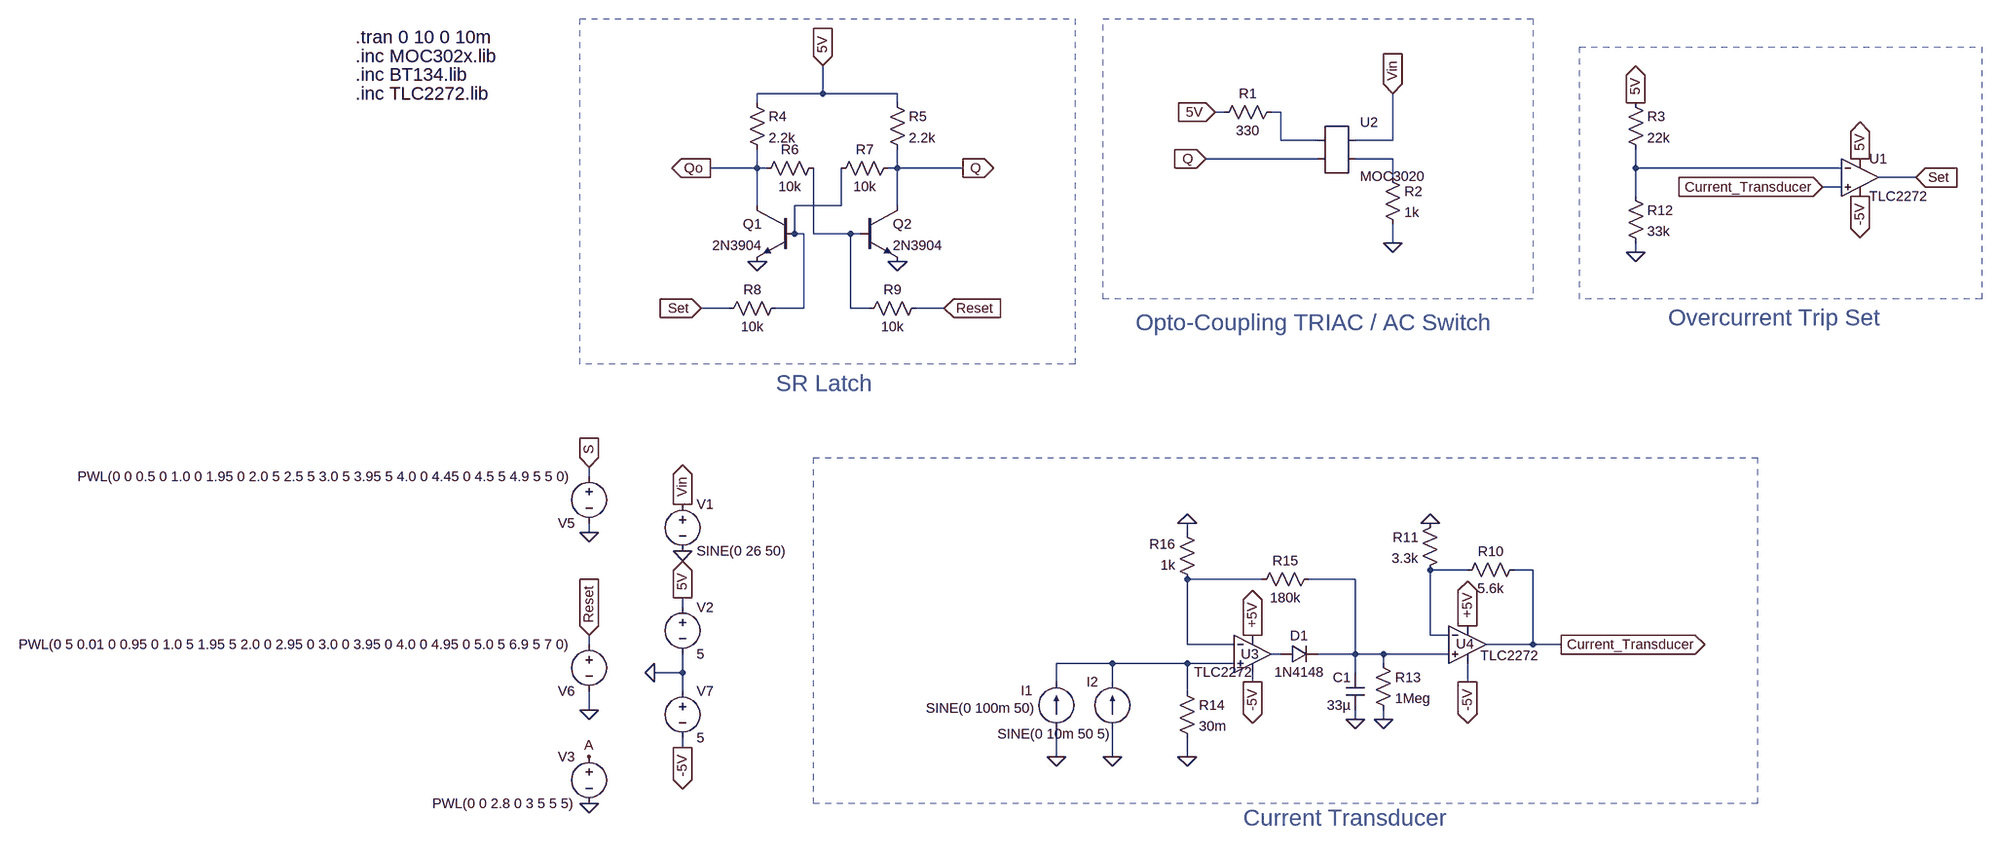
[diagram p0: schematic Muthua_21317682_A3.asc]
Muthua_21317682_A3.asc, the LTspice schematic file:
Version 4
SHEET 1 2180 916
WIRE 128 -480 128 -528
WIRE 128 -480 16 -480
WIRE 256 -480 128 -480
WIRE 16 -464 16 -480
WIRE 256 -464 256 -480
WIRE 816 -448 800 -448
WIRE 912 -448 896 -448
WIRE 912 -400 912 -448
WIRE 976 -400 912 -400
WIRE 1104 -400 1104 -480
WIRE 1104 -400 1040 -400
WIRE 976 -368 784 -368
WIRE 1104 -368 1040 -368
WIRE 16 -352 16 -384
WIRE 16 -352 -64 -352
WIRE 32 -352 16 -352
WIRE 256 -352 256 -384
WIRE 256 -352 240 -352
WIRE 368 -352 256 -352
WIRE 1520 -352 1520 -384
WIRE 1872 -352 1520 -352
WIRE 1104 -336 1104 -368
WIRE 2000 -336 1936 -336
WIRE 1872 -320 1840 -320
WIRE 1520 -304 1520 -352
WIRE 16 -288 16 -352
WIRE 160 -288 160 -352
WIRE 160 -288 80 -288
WIRE 256 -288 256 -352
WIRE 80 -240 80 -288
WIRE 96 -240 80 -240
WIRE 112 -240 112 -352
WIRE 176 -240 112 -240
WIRE 192 -240 176 -240
WIRE 1104 -224 1104 -256
WIRE 1520 -208 1520 -224
WIRE -32 -112 -80 -112
WIRE 96 -112 96 -240
WIRE 96 -112 48 -112
WIRE 176 -112 176 -240
WIRE 208 -112 176 -112
WIRE 336 -112 288 -112
WIRE -272 176 -272 160
WIRE -272 272 -272 256
WIRE 752 272 752 256
WIRE 1232 336 1168 336
WIRE 1344 336 1312 336
WIRE 880 352 752 352
WIRE 1040 352 960 352
WIRE -112 400 -112 384
WIRE 1168 448 1168 336
WIRE 1200 448 1168 448
WIRE -272 464 -272 448
WIRE 752 464 752 352
WIRE 832 464 752 464
WIRE 1344 464 1344 336
WIRE 1344 464 1264 464
WIRE 1392 464 1344 464
WIRE 912 480 896 480
WIRE 1040 480 1040 352
WIRE 1040 480 976 480
WIRE 1088 480 1040 480
WIRE 1200 480 1088 480
WIRE 624 496 528 496
WIRE 752 496 624 496
WIRE 832 496 752 496
WIRE 1088 496 1088 480
WIRE -112 512 -112 480
WIRE -112 512 -160 512
WIRE 1040 512 1040 480
WIRE 528 528 528 496
WIRE 624 528 624 496
WIRE 864 528 864 512
WIRE 1232 528 1232 496
WIRE -112 544 -112 512
WIRE 752 544 752 496
WIRE -272 576 -272 544
WIRE 1040 592 1040 576
WIRE 1088 592 1088 576
WIRE -112 640 -112 624
WIRE 528 656 528 608
WIRE 624 656 624 608
WIRE 752 656 752 624
FLAG -160 512 0
FLAG -112 304 0
FLAG -112 384 5V
IOPIN -112 384 Out
FLAG -112 224 Vin
IOPIN -112 224 Out
FLAG 1104 -480 Vin
IOPIN 1104 -480 In
FLAG 800 -448 5V
IOPIN 800 -448 In
FLAG -272 736 0
FLAG 16 -192 0
FLAG 256 -192 0
FLAG -80 -112 Set
IOPIN -80 -112 In
FLAG 336 -112 Reset
IOPIN 336 -112 In
FLAG -272 272 0
FLAG -272 576 0
FLAG -272 448 Reset
IOPIN -272 448 In
FLAG 368 -352 Q
IOPIN 368 -352 Out
FLAG -64 -352 Qo
IOPIN -64 -352 Out
FLAG 1104 -224 0
FLAG -272 656 A
FLAG 784 -368 Q
IOPIN 784 -368 In
FLAG -112 640 -5V
IOPIN -112 640 Out
FLAG 1904 -368 5V
IOPIN 1904 -368 Out
FLAG 1904 -304 -5V
IOPIN 1904 -304 Out
FLAG 1520 -208 0
FLAG 1520 -464 5V
IOPIN 1520 -464 Out
FLAG 2000 -336 Set
IOPIN 2000 -336 In
FLAG 128 -528 5V
IOPIN 128 -528 In
FLAG -272 160 S
IOPIN -272 160 In
FLAG 1040 592 0
FLAG 1168 256 0
FLAG 1088 592 0
FLAG 752 656 0
FLAG 752 256 0
FLAG 624 656 0
FLAG 528 656 0
FLAG 864 448 +5V
IOPIN 864 448 Out
FLAG 1232 432 +5V
IOPIN 1232 432 Out
FLAG 864 528 -5V
IOPIN 864 528 Out
FLAG 1232 528 -5V
IOPIN 1232 528 Out
FLAG 1392 464 Current_Transducer
IOPIN 1392 464 Out
FLAG 1840 -320 Current_Transducer
IOPIN 1840 -320 In
SYMBOL AutoGenerated\\MOC3020 1008 -384 R0
SYMATTR InstName U2
SYMBOL voltage -112 208 R0
WINDOW 123 0 0 Left 2
WINDOW 39 0 0 Left 2
SYMATTR InstName V1
SYMATTR Value SINE(0 26 50)
SYMBOL voltage -112 384 R0
WINDOW 123 0 0 Left 2
WINDOW 39 0 0 Left 2
SYMATTR InstName V2
SYMATTR Value 5
SYMBOL res 912 -464 R90
WINDOW 0 0 56 VBottom 2
WINDOW 3 32 56 VTop 2
SYMATTR InstName R1
SYMATTR Value 330
SYMBOL voltage -272 640 M0
WINDOW 123 0 0 Left 2
WINDOW 39 0 0 Left 2
SYMATTR InstName V3
SYMATTR Value PWL(0 0 2.8 0 3 5 5 5)
SYMBOL npn 80 -288 M0
SYMATTR InstName Q1
SYMATTR Value 2N3904
SYMBOL npn 192 -288 R0
SYMATTR InstName Q2
SYMATTR Value 2N3904
SYMBOL res 0 -480 R0
SYMATTR InstName R4
SYMATTR Value 2.2k
SYMBOL res 240 -480 R0
SYMATTR InstName R5
SYMATTR Value 2.2k
SYMBOL res 128 -368 R90
WINDOW 0 0 56 VBottom 2
WINDOW 3 32 56 VTop 2
SYMATTR InstName R6
SYMATTR Value 10k
SYMBOL res 256 -368 R90
WINDOW 0 0 56 VBottom 2
WINDOW 3 32 56 VTop 2
SYMATTR InstName R7
SYMATTR Value 10k
SYMBOL res 64 -128 R90
WINDOW 0 0 56 VBottom 2
WINDOW 3 32 56 VTop 2
SYMATTR InstName R8
SYMATTR Value 10k
SYMBOL res 304 -128 R90
WINDOW 0 0 56 VBottom 2
WINDOW 3 32 56 VTop 2
SYMATTR InstName R9
SYMATTR Value 10k
SYMBOL voltage -272 160 M0
WINDOW 0 24 96 Left 2
WINDOW 3 24 16 Left 2
WINDOW 123 0 0 Left 0
WINDOW 39 0 0 Left 0
SYMATTR InstName V5
SYMATTR Value PWL(0 0 0.5 0 1.0 0 1.95 0 2.0 5 2.5 5 3.0 5 3.95 5 4.0 0 4.45 0 4.5 5 4.9 5 5 0)
SYMBOL voltage -272 448 M0
WINDOW 0 24 96 Left 2
WINDOW 3 24 16 Left 2
WINDOW 123 0 0 Left 0
WINDOW 39 0 0 Left 0
SYMATTR InstName V6
SYMATTR Value PWL(0 5 0.01 0 0.95 0 1.0 5 1.95 5 2.0 0 2.95 0 3.0 0 3.95 0 4.0 0 4.95 0 5.0 5 6.9 5 7 0)
SYMBOL res 1088 -352 R0
SYMATTR InstName R2
SYMATTR Value 1k
SYMBOL Opamps\\opamp2 1904 -400 R0
SYMATTR InstName U1
SYMATTR Value TLC2272
SYMATTR SpiceModel TLC2272
SYMBOL voltage -112 528 R0
WINDOW 123 0 0 Left 2
WINDOW 39 0 0 Left 2
SYMATTR InstName V7
SYMATTR Value 5
SYMBOL res 1504 -480 R0
SYMATTR InstName R3
SYMATTR Value 22k
SYMBOL res 1504 -320 R0
SYMATTR InstName R12
SYMATTR Value 33k
SYMBOL Opamps\\opamp2 864 416 R0
WINDOW 0 -20 64 Left 2
WINDOW 3 -100 95 Left 2
SYMATTR InstName U3
SYMATTR Value TLC2272
SYMATTR SpiceModel TLC2272
SYMBOL Opamps\\opamp2 1232 400 R0
WINDOW 0 -20 63 Left 2
WINDOW 3 22 83 Left 2
SYMATTR InstName U4
SYMATTR Value TLC2272
SYMATTR SpiceModel TLC2272
SYMBOL diode 912 496 R270
WINDOW 0 32 32 VTop 2
WINDOW 3 0 32 VBottom 2
SYMATTR InstName D1
SYMATTR Value 1N4148
SYMBOL cap 1056 512 M0
SYMATTR InstName C1
SYMATTR Value 33µ
SYMBOL res 1328 320 R90
WINDOW 0 0 56 VBottom 2
WINDOW 3 32 56 VTop 2
SYMATTR InstName R10
SYMATTR Value 5.6k
SYMBOL res 1184 240 M0
SYMATTR InstName R11
SYMATTR Value 3.3k
SYMBOL res 1072 480 R0
SYMATTR InstName R13
SYMATTR Value 1Meg
SYMBOL res 736 528 R0
SYMATTR InstName R14
SYMATTR Value 30m
SYMBOL current 528 608 R180
WINDOW 0 40 65 Left 2
WINDOW 3 36 35 Left 2
WINDOW 123 0 0 Left 0
WINDOW 39 0 0 Left 0
SYMATTR InstName I1
SYMATTR Value SINE(0 100m 50)
SYMBOL current 624 608 R180
WINDOW 0 24 80 Left 2
WINDOW 3 3 -9 Left 2
WINDOW 123 0 0 Left 0
WINDOW 39 0 0 Left 0
SYMATTR InstName I2
SYMATTR Value SINE(0 10m 50 5)
SYMBOL res 976 336 R90
WINDOW 0 0 56 VBottom 2
WINDOW 3 32 56 VTop 2
SYMATTR InstName R15
SYMATTR Value 180k
SYMBOL res 768 368 R180
WINDOW 0 36 76 Left 2
WINDOW 3 36 40 Left 2
SYMATTR InstName R16
SYMATTR Value 1k
TEXT -672 -544 Left 3 !.inc MOC302x.lib
TEXT -672 -512 Left 3 !.inc BT134.lib
TEXT -672 -576 Left 3 !.tran 0 10 0 10m
TEXT -672 -480 Left 3 !.inc TLC2272.lib
TEXT 848 760 Left 4 ;Current Transducer
TEXT 48 16 Left 4 ;SR Latch
TEXT 664 -88 Left 4 ;Opto-Coupling TRIAC / AC Switch
TEXT 1576 -96 Left 4 ;Overcurrent Trip Set
RECTANGLE Normal 1728 736 112 144 3
RECTANGLE Normal 560 -16 -288 -608 3
RECTANGLE Normal 1344 -128 608 -608 3
RECTANGLE Normal 2112 -128 1424 -560 3

The netlist it stands for:
* Muthua_21317682_A3.asc
* U2: MOC3020 (symbol AutoGenerated\MOC3020 not available, pins judged from their places): pin1=N001 pin2=Q pin3=Vin pin4=N002
V1 Vin 0 SINE(0 26 50)
V2 5V 0 5
R1 N001 5V 330
V3 A 0 PWL(0 0 2.8 0 3 5 5 5)
Q1 Qo N004 0 0 2N3904
Q2 Q N005 0 0 2N3904
R4 5V Qo 2.2k
R5 5V Q 2.2k
R6 N005 Qo 10k
R7 Q N004 10k
R8 N004 Set 10k
R9 Reset N005 10k
V5 S 0 PWL(0 0 0.5 0 1.0 0 1.95 0 2.0 5 2.5 5 3.0 5 3.95 5 4.0 0 4.45 0 4.5 5 4.9 5 5 0)
V6 Reset 0 PWL(0 5 0.01 0 0.95 0 1.0 5 1.95 5 2.0 0 2.95 0 3.0 0 3.95 0 4.0 0 4.95 0 5.0 5 6.9 5 7 0)
R2 N002 0 1k
XU1 Current_Transducer N003 5V -5V Set TLC2272 TLC2272  ; pins In+ In- V+ V- OUT
V7 0 -5V 5
R3 5V N003 22k
R12 N003 0 33k
XU3 N010 N007 +5V -5V N009 TLC2272 TLC2272  ; pins In+ In- V+ V- OUT
XU4 N008 N006 +5V -5V Current_Transducer TLC2272 TLC2272  ; pins In+ In- V+ V- OUT
D1 N009 N008 1N4148
C1 N008 0 33µ
R10 Current_Transducer N006 5.6k
R11 0 N006 3.3k
R13 N008 0 1Meg
R14 N010 0 30m
I1 0 N010 SINE(0 100m 50)
I2 0 N010 SINE(0 10m 50 5)
R15 N008 N007 180k
R16 N007 0 1k
.model D D
.lib standard.dio
.model NPN NPN
.model PNP PNP
.lib standard.bjt
.inc MOC302x.lib
.inc BT134.lib
.tran 0 10 0 10m
.inc TLC2272.lib
* Current Transducer
* SR Latch
* Opto-Coupling TRIAC / AC Switch
* Overcurrent Trip Set
.backanno
.end